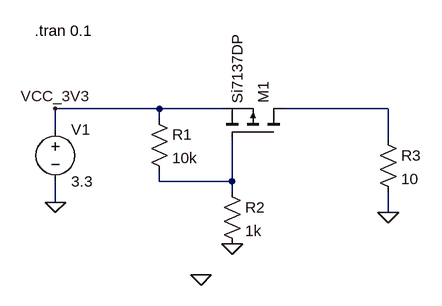
[diagram p0: schematic PMOS.asc]
PMOS.asc, the LTspice schematic file:
Version 4
SHEET 1 880 680
WIRE 272 128 112 128
WIRE 368 128 272 128
WIRE 624 128 464 128
WIRE 272 144 272 128
WIRE 112 160 112 128
WIRE 624 176 624 128
WIRE 272 240 272 224
WIRE 384 240 384 176
WIRE 384 240 272 240
WIRE 384 256 384 240
WIRE 112 272 112 240
WIRE 624 288 624 256
FLAG 112 272 0
FLAG 336 384 0
FLAG 112 128 VCC_3V3
FLAG 624 288 0
FLAG 384 336 0
SYMBOL voltage 112 144 R0
WINDOW 123 0 0 Left 0
WINDOW 39 0 0 Left 0
SYMATTR InstName V1
SYMATTR Value 3.3
SYMBOL pmos 464 176 M270
SYMATTR InstName M1
SYMATTR Value Si7137DP
SYMBOL res 256 128 R0
SYMATTR InstName R1
SYMATTR Value 10k
SYMBOL res 368 240 R0
SYMATTR InstName R2
SYMATTR Value 1k
SYMBOL res 608 160 R0
SYMATTR InstName R3
SYMATTR Value 10
TEXT 80 8 Left 2 !.tran 0.1

The netlist it stands for:
* PMOS.asc
V1 VCC_3V3 0 3.3
M1 N001 N002 VCC_3V3 VCC_3V3 Si7137DP
R1 VCC_3V3 N002 10k
R2 N002 0 1k
R3 N001 0 10
.model NMOS NMOS
.model PMOS PMOS
.lib standard.mos
.tran 0.1
.backanno
.end